# EAGLE design 04B-340 (EAGLE 9.6.2)
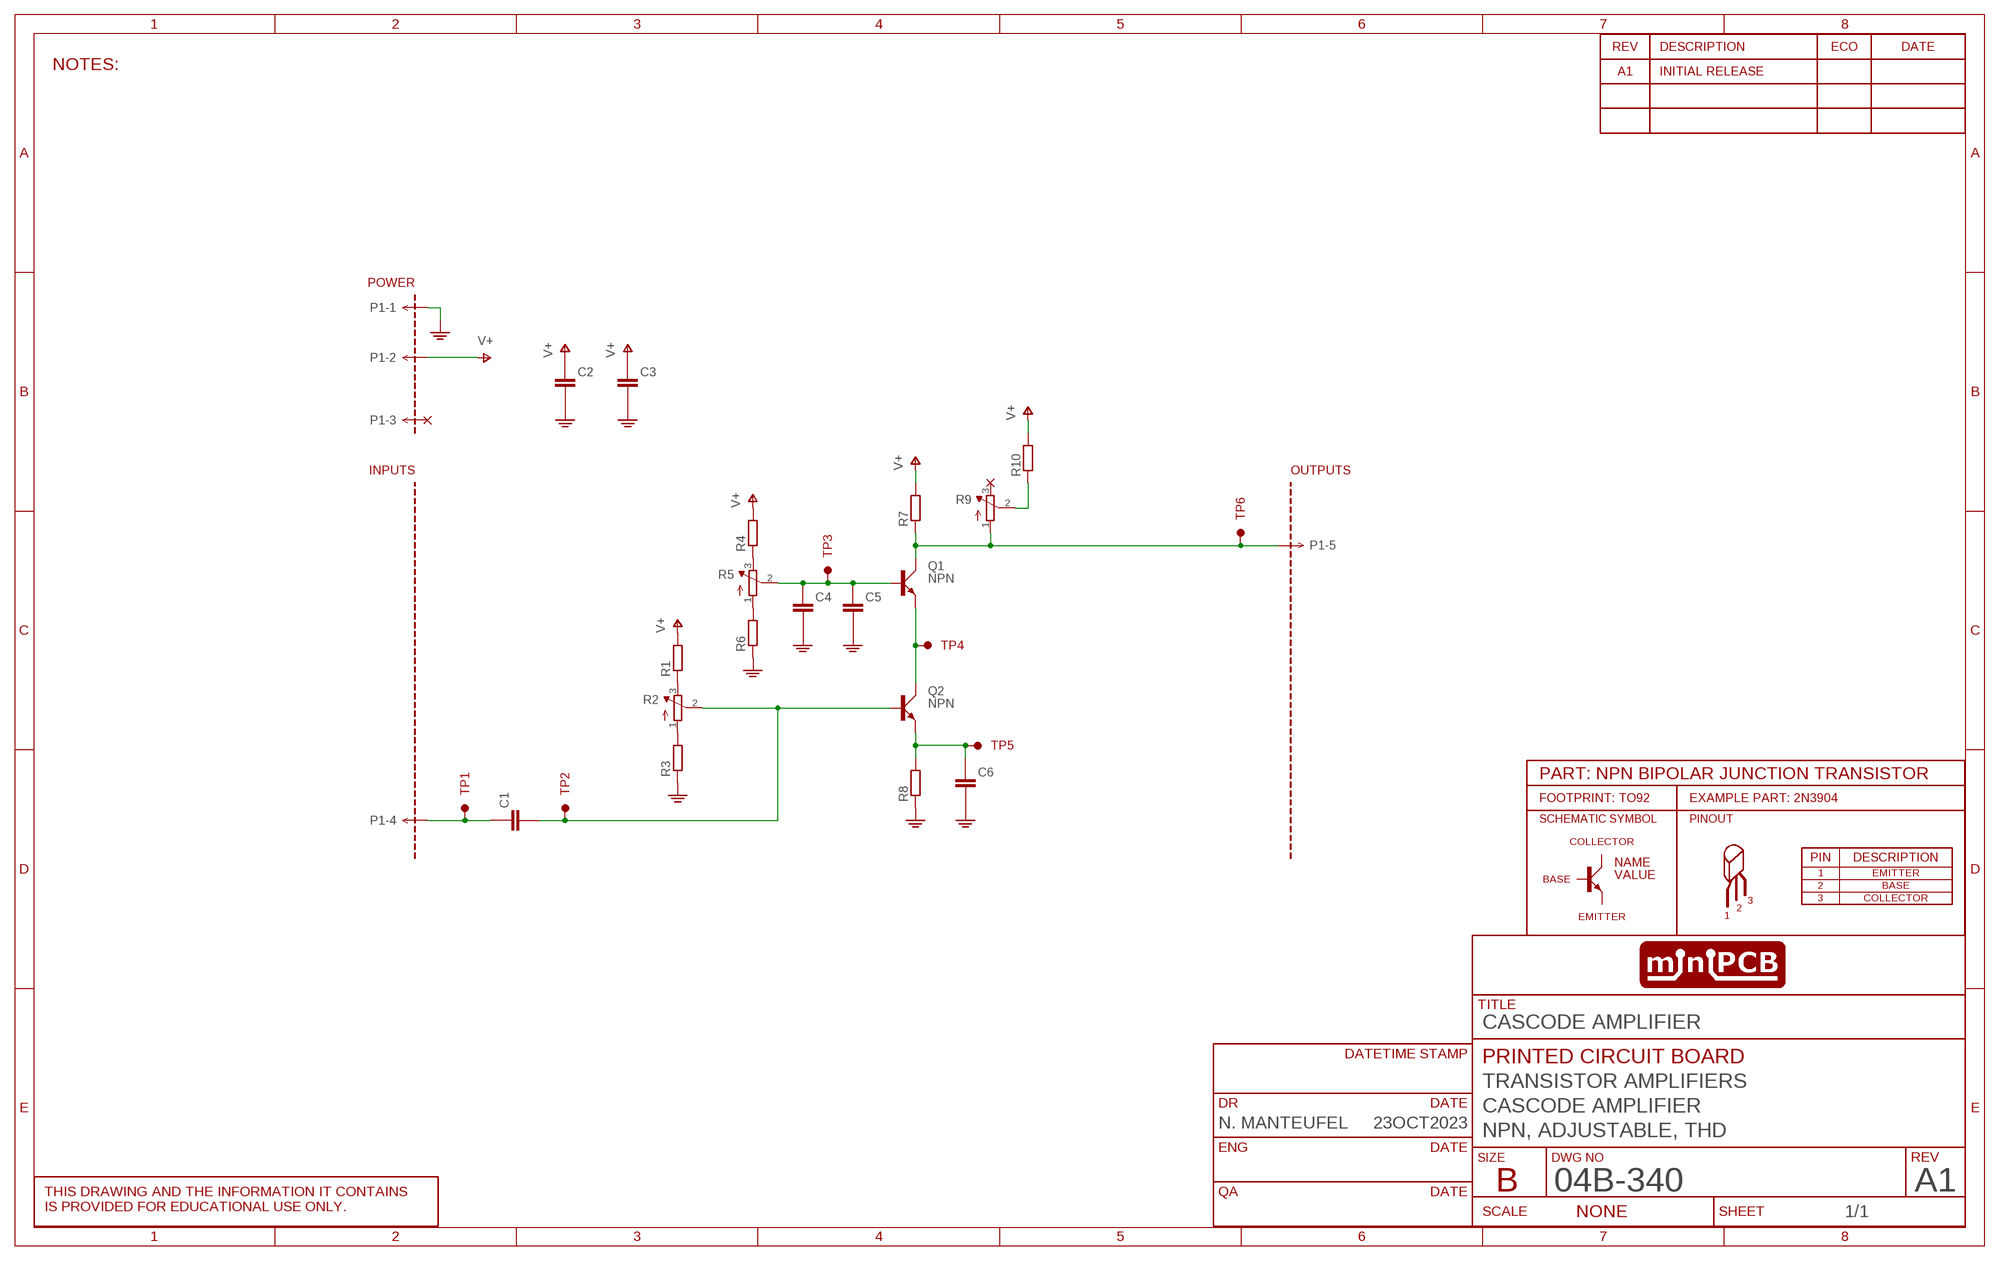
[diagram p0: schematic, sheet 1]
SHEET1 (SCHEMATIC): CIRCUIT_CATEGORY: TRANSISTOR AMPLIFIERS; CIRCUIT_NAME: CASCODE AMPLIFIER; CIRCUIT_VARIANT: NPN, ADJUSTABLE, THD; DR: N. MANTEUFEL; DR_DATE: 23OCT2023; PCB_PCBA: PRINTED CIRCUIT BOARD; REVA: A1; REVISION: A1; TITLE: CASCODE AMPLIFIER

## Parts
C1  CAPACITORTHD  [C050-024X044]
C2  CAPACITOR_10  [C5MM]
C3  CAPACITORTHD  [C050-024X044]
C4  CAPACITORTHD  [C050-024X044]
C5  CAPACITOR_10  [C5MM]
C6  CAPACITOR_10  [C5MM]
P1  MINIPCB_5P5P  [PINS_1X5]
PCB1  MINIPCB_0P50X50  [MINIPCB_0P_50X50MM]
Q1  NPN  BJT_NPNEBC  [TO92-EBC-OVAL]
Q2  NPN  BJT_NPNEBC  [TO92-EBC-OVAL]
R1  RESISTORTHD  [0204/10]
R2  TRIMPOT0.100THD  [TRIM_0100]
R3  RESISTORTHD  [0204/10]
R4  RESISTORTHD  [0204/10]
R5  TRIMPOT0.100THD  [TRIM_0100]
R6  RESISTORTHD  [0204/10]
R7  RESISTORTHD  [0204/10]
R8  RESISTORTHD  [0204/10]
R9  TRIMPOT0.100THD  [TRIM_0100]
R10  RESISTORTHD  [0204/10]
TP1  TESTPOINTKE5000-SMTEXT  [PINS_1_TESTPOINT_KE5000_NOTEXT]
TP2  TESTPOINTKE5000-SMTEXT  [PINS_1_TESTPOINT_KE5000_NOTEXT]
TP3  TESTPOINTKE5000-SMTEXT  [PINS_1_TESTPOINT_KE5000_NOTEXT]
TP4  TESTPOINTKE5000-SMTEXT  [PINS_1_TESTPOINT_KE5000_NOTEXT]
TP5  TESTPOINTKE5000-SMTEXT  [PINS_1_TESTPOINT_KE5000_NOTEXT]
TP6  TESTPOINTKE5000-SMTEXT  [PINS_1_TESTPOINT_KE5000_NOTEXT]

## Nets
GND: C2.- C3.2(-) C4.2(-) C5.- C6.- P1.1 R3.1 R6.1 R8.1
N$1: R2.1(A) R3.2
N$2: C1.2(-) Q2.B R2.2(S) TP2.1
N$3: C4.1(+) C5.+ Q1.B R5.2(S) TP3.1
N$4: R1.1 R2.3(E)
N$5: R4.1 R5.3(E)
N$6: R5.1(A) R6.2
N$7: C1.1(+) P1.4 TP1.1
N$8: Q1.E Q2.C TP4.1
N$9: P1.5 Q1.C R7.1 R9.1(A) TP6.1
N$10: C6.+ Q2.E R8.2 TP5.1
N$11: R9.2(S) R10.1
V+: C2.+ C3.1(+) P1.2 R1.2 R4.2 R7.2 R10.2
Unconnected: P1.3 R9.3(E)

## Notes on the sheet
- NOTES:

## Library data of the parts
C1-C6 = minipcb:CAPACITOR
P1 = minipcb:MINIPCB_5P
PCB1 = minipcb:MINIPCB_0P; CIRCUIT_CATEGORY: TRANSISTOR AMPLIFIERS; PART_NUMBER: 04B-340; REVISION: A1-01; TITLE: CASCODE AMPLIFIER
Q1 Q2 = minipcb:BJT_NPN: TRANSISTOR
R1 R3 R4 R6-R8 R10 = minipcb:RESISTOR
R2 R5 R9 = minipcb:TRIMPOT: SMT trimmer potentiometer part number TC33X http://www.ladyada.net/library/eagle
TP1-TP6 = minipcb:TESTPOINT

## Board
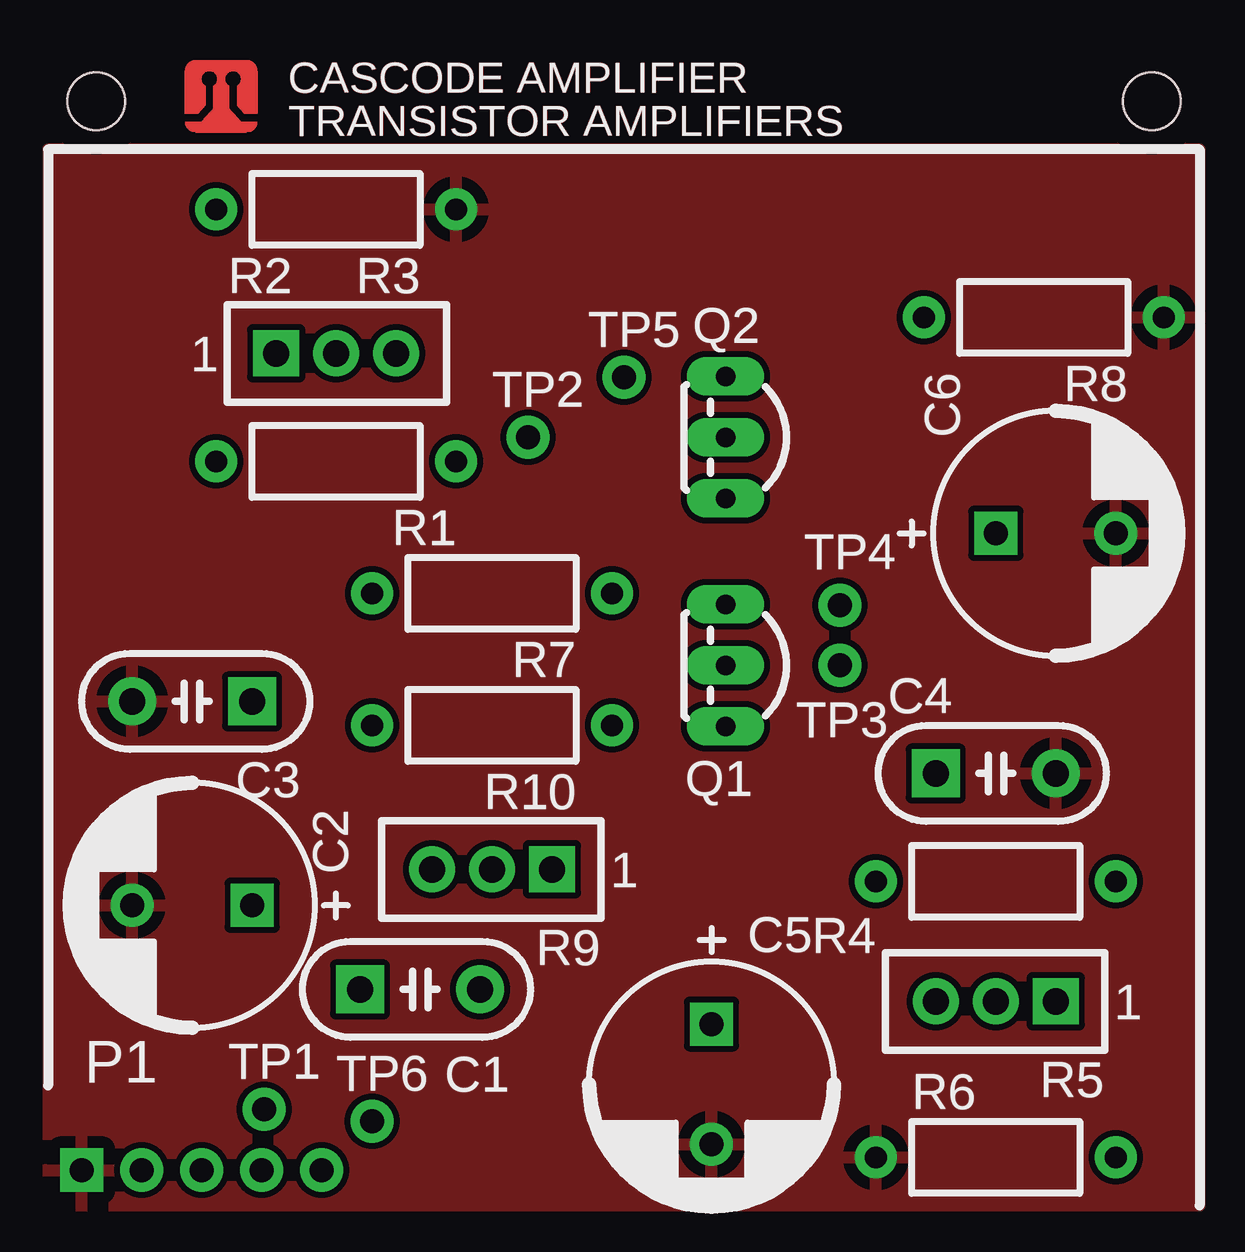
[diagram p1: board, top side]
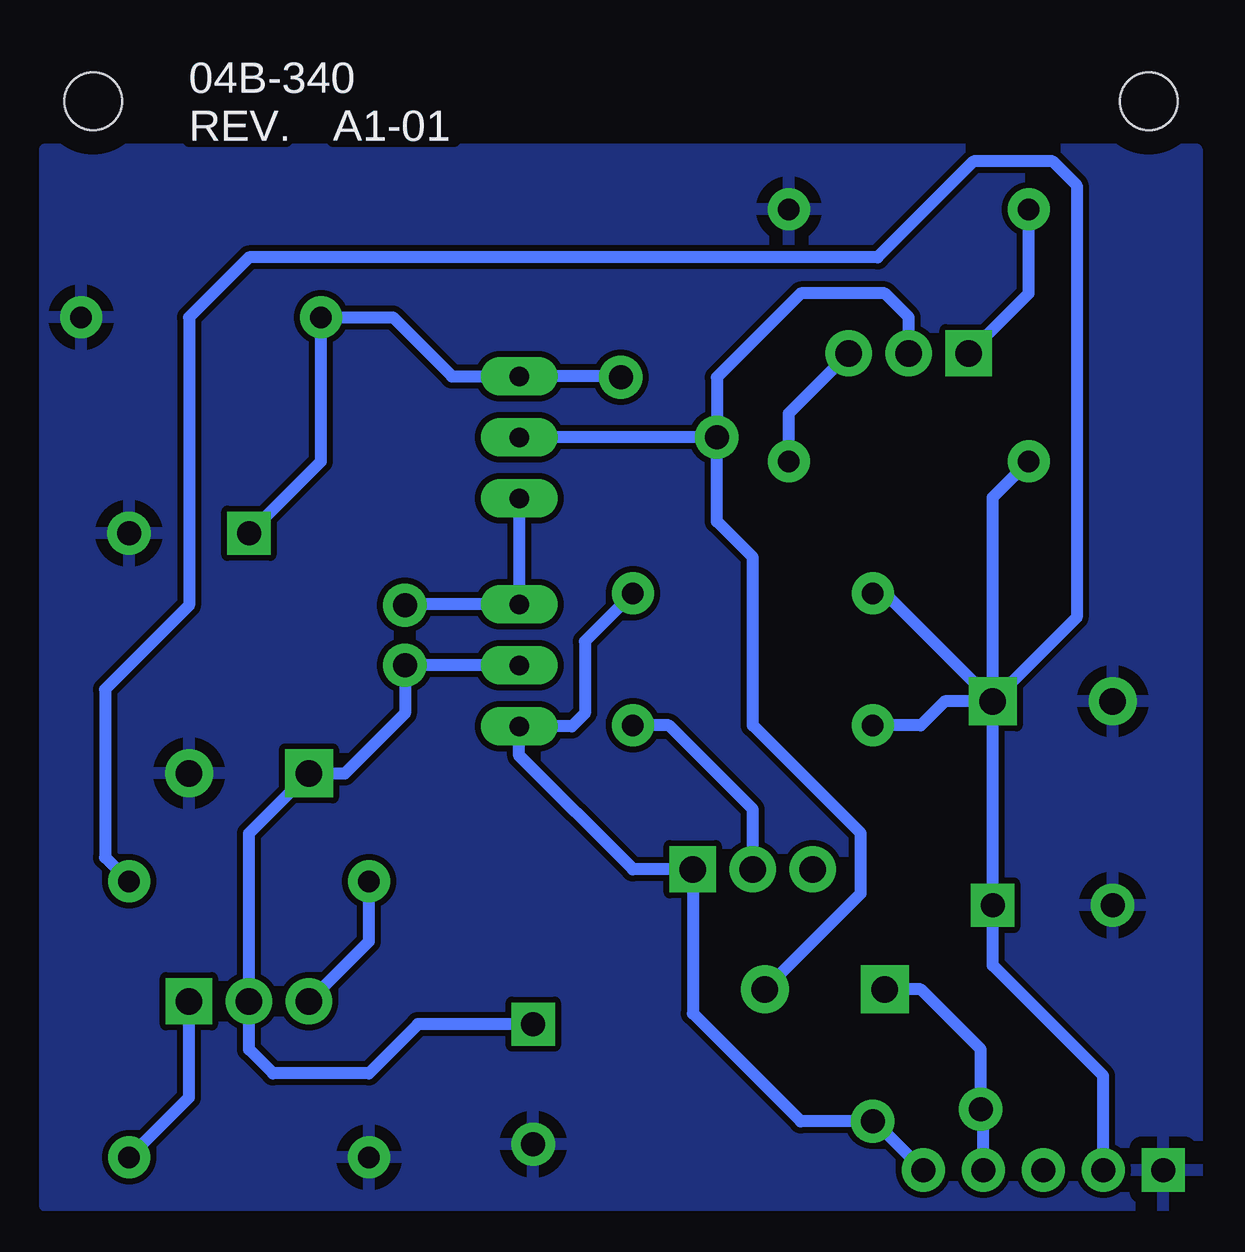
[diagram p2: board, bottom side, seen from below]

No outline drawn. Coordinates in mm, seen from the top.
Copper layers (1*16): Top 0.035mm / dielectric 1.5mm / Bottom 0.035mm
Design rules "minipcb": minimum track width 0.2mm, minimum drill 0.5mm, track to track 0.25mm, track to pad 0.5mm, pad to pad 0.5mm, via to via 0.5mm, smd to smd 0.15mm, copper to edge 1mm, drill to drill 1mm, minimum pad ring 0.4mm, minimum via ring 0.4mm, stop-mask expansion 0.1mm, vias tented up to drill 0.6mm, thermal gap 0.5mm

### Footprints (pad centres in the part's own frame; a part is rotated, then mirrored left to right if it is on the bottom)
C050-024X044 = drill 1.1 pad 2 square: 1 -2.5,0 | drill 1.1 pad 2: 2 2.5,0
C5MM = drill 1 square: + -2.5,0 | drill 1: - 2.5,0
PINS_1X5 = drill 1 square: 1 0,0 | drill 1: 2 2.5,0; 3 5,0; 4 7.5,0; 5 10,0
MINIPCB_0P_50X50MM = hole 2.4: 47,47; 3,47
TO92-EBC-OVAL = drill 0.813 long: B 0,-1.27; C 2.54,-1.27; E -2.54,-1.27
0204/10 = drill 0.9 pad 1.75: 1 -5,0; 2 5,0
TRIM_0100 = drill 1.1 pad 1.93 square: 1 0,0 | drill 1.1 pad 1.93: 2 2.5,0; 3 5,0
PINS_1_TESTPOINT_KE5000_NOTEXT = drill 1: 1 0,0

### Placement (x,y rotation side)
C1  16.5,10 0 top
C2  7,13.5 180 top
C3  7,22 180 top
C4  40.5,19 0 top
C5  28.65,6.05 270 top
C6  43,29 0 top
P1  2.39,2.47 0 top
PCB1  0,0 0 top
Q1  30.5,23.5 270 top
Q2  30.5,33 270 top
R1  13,32 180 top
R2  10.5,36.5 0 top
R3  13,42.5 180 top
R4  40.5,14.5 0 top
R5  43,9.5 180 top
R6  40.5,3 0 top
R7  19.5,26.5 180 top
R8  42.5,38 180 top
R9  22,15 180 top
R10  19.5,21 180 top
TP1  10,5 0 top
TP2  21,33 0 top
TP3  34,23.5 270 top
TP4  34,26 0 top
TP5  25,35.5 0 top
TP6  14.5,4.5 0 top

### Tracks (layer width: path | path; a pad name or v marks a point on that pad's centre or on a via)
GND
  pour Top: 1,1 49,1 49,45 1,45
  pour Bottom: 1,1 49,1 49,45 1,45
N$1
  Bottom 0.5: R2.1 8,39 R3.2
N$2
  Bottom 0.5: R2.2 13,38 14,39 17.5,39 21,35.5 TP2.1 | TP2.1 Q2.B | C1.2 15,14 15,16.5 19.5,21 19.5,28 21,29.5 TP2.1
N$3
  Bottom 0.5: Q1.B TP3.1 34,21.5 36.5,19 C4.1 40.5,16.5 R5.2 40.5,7.5 39.5,6.5 35.5,6.5 33.45,8.55 C5.+
N$4
  Bottom 0.5: R1.1 18,34 R2.3
N$5
  Bottom 0.5: R5.3 35.5,12 R4.1
N$6
  Bottom 0.5: R6.2 43,5.5 R5.1
N$7
  Bottom 0.5: P1.4 9.89,4.89 TP1.1 10,7.5 12.5,10 C1.1
N$8
  Bottom 0.5: Q2.C Q1.E 33.96,26.04 TP4.1
N$9
  Bottom 0.5: P1.5 14.42,4.5 TP6.1 17.5,4.5 22,9 R9.1 24.5,15 29.23,19.73 Q1.C 27.04,20.96 26.5,21.5 26.5,24.5 R7.1
N$10
  Bottom 0.5: TP5.1 25.04,35.54 Q2.E 32.04,35.54 34.5,38 R8.2 37.5,32 C6.+
N$11
  Bottom 0.5: R9.2 19.5,17.5 23,21 R10.1
V+
  Bottom 0.5: P1.2 4.89,6.39 9.5,11 C2.+ C3.1 | C3.1 11.5,22 12.5,21 R10.2 | R7.2 14,26.5 C3.1 | C3.1 9.5,30.5 R1.2 | R4.2 46.5,15.5 46.5,22.5 43,26 43,38 40.5,40.5 14.3,40.5 10.3,44.5 7,44.5 6,43.5 6,25.5 C3.1

### Text on the board
_tNames: R3 | R2 | TP5 | Q2 | R8 | TP2 | C6 | R1 | TP4 | R7 | C4 | TP3 | C3 | Q1 | R10 | C2 | R4 | R9 | C5 | C1 | R5 | TP1 | TP6 | R6